# Altium project BPC_PWR_v1.1.PrjPcb (part 3 of 4)
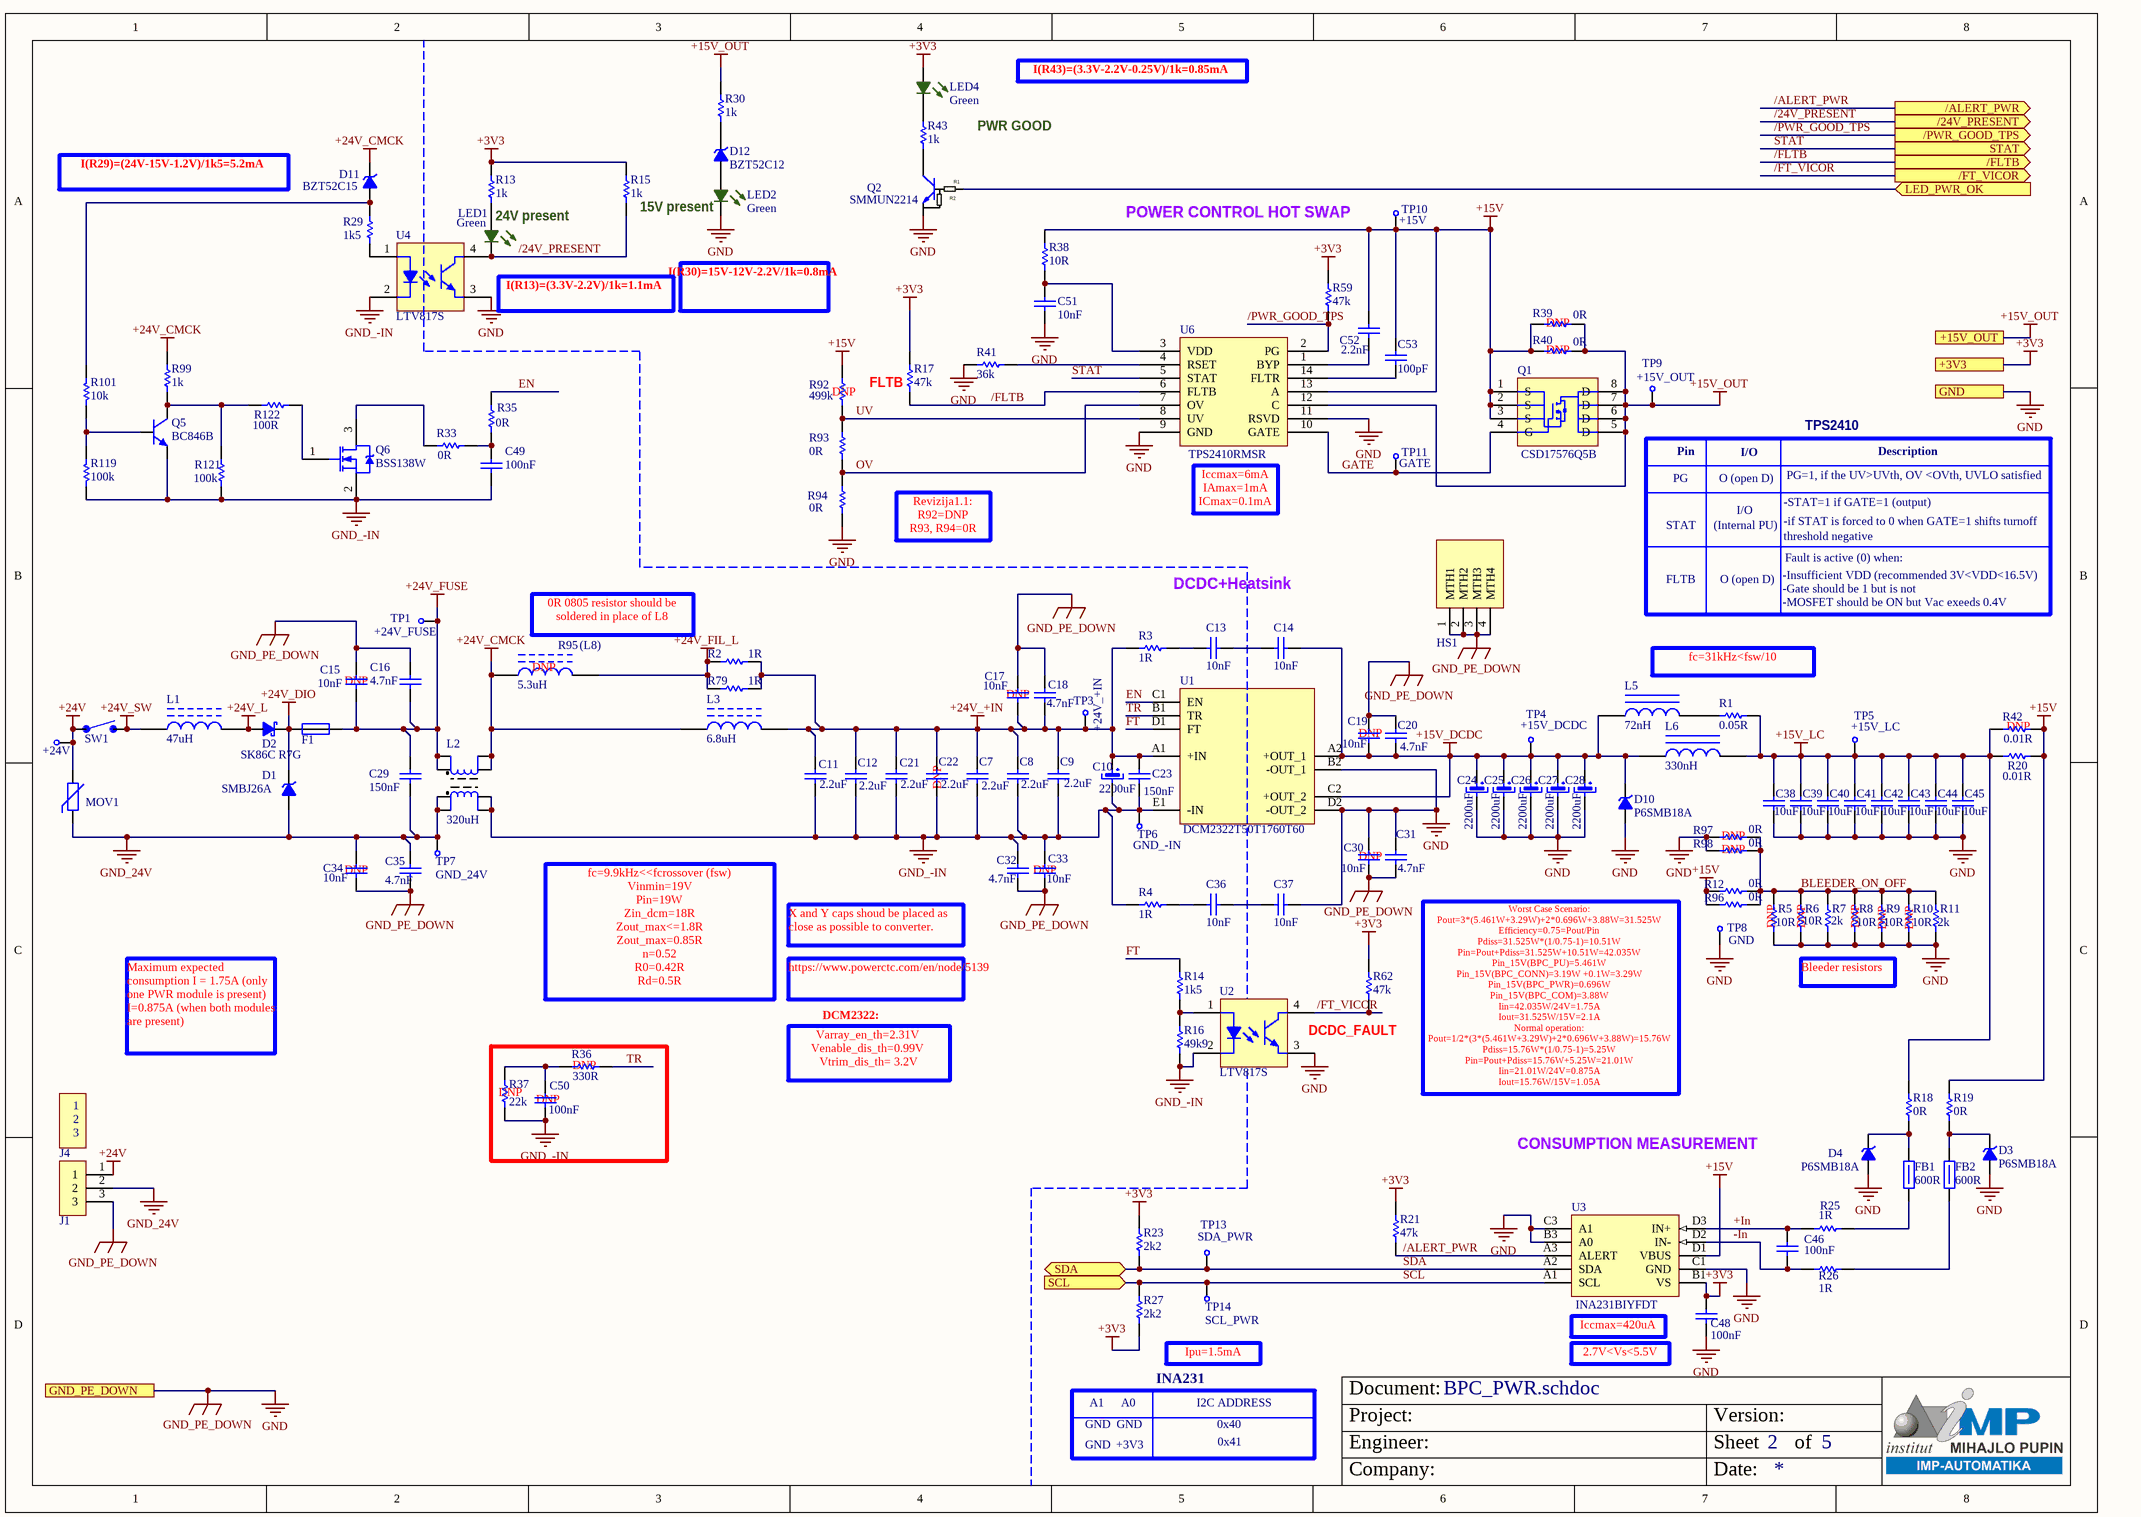
[diagram p6: BPC_PWR.schdoc]

## Sheet BPC_PWR.schdoc: Eurocard VME 6U (9.187 x 6.299 inches) (continued)
### Library data of the parts
+24V TP1 TP3-TP11 TP13 TP14 = Test Point SMD: Test Point SMD 1.2 mm No Via; DB Parameter 2: 1.2mm; DB Parameter 3: SMD No Via; Last Revision Date: 29.01.2018.; Package: N/A; Mounting: N/A; DB Parameter 1: *
C7-C9 C11 C12 C21 C22 = Cap Cer 2.2uF 450V X7R 2220 MS: Ceramic Capacitor 2.2uF 100V X6S 2220; Manufacturer: TDK Corporation; Manufacturer Part Number: C5750X6S2W225K250KA; Voltage: 450V; Tolerance: ±20%; Production status: Active; Distributor: Digi-Key; Distributor Part Number: 445-7781-1-ND; Last Revision Date: 09.03.2021; Temperature Range: -55°C ~ +125°C; Mounting: SMD; ComponentLink1Description: Datasheet; ComponentLink1URL: https://product.tdk.com/info/en/documents/chara_sheet/C5750X6S2W225K250KA.pdf; ComponentLink2Description: Distributor; ComponentLink2URL: https://www.digikey.com/en/products/detail/tdk-corporation/C5750X6S2W225K250KA/2733216?s=N4IgTCBcDaIMIFYDsCAMANAbAZTAdTDAQGkjViBBEAXQF8g; ComponentLink3Description: Manufacturer; ComponentLink3URL: https://product.tdk.com/en/search/capacitor/ceramic/mlcc/info?part_no=C5750X6S2W225K250KA; Status: Not Checked; Dielectric: X6S; ComponentLink4Description: Specsheet; ComponentLink4URL: https://product.tdk.com/info/en/documents/chara_sheet/C5750X6S2W225K250KA.pdf; DB Parameter 1: 2.2uF; DB Parameter 2: 450V; DB Parameter 3: X6S
C10 C24-C28 = Cap El 2200uF 35V 18x20mm MS: Electorlytic Capacitor 2200uF 35V 18x20mm MS; Manufacturer: Nichicon; Manufacturer Part Number: URZ1V222MHD; Tolerance: ±20%; Ripple Current: 1,27A @ 10KHz; Production Status: Active; Distributor: Digi-Key; Distributor Part Number: 493-15957-ND; Last Revision Date: 17.03.2021; Temperature Range: -55°C ~ +105°C; Mounting: TH; ComponentLink1Description: Datasheet; ComponentLink1URL: https://www.nichicon.co.jp/english/products/pdfs/e-urz.pdf; ComponentLink2Description: Distributor; ComponentLink2URL: https://www.digikey.com/en/products/detail/nichicon/URZ1V222MHD/2538996; ComponentLink3Description: Manufacturer; ComponentLink3URL: https://products.nichicon.co.jp/en/part_search/part_list.cfm#; Status: Unchecked; Voltage: 35V; ESR: -; DB Parameter 1: 2200uF; DB Parameter 2: 35V
C13 C14 C36 C37 = Cap Cer 10nF 2kV X7R 1812 MS: Ceramic Capacitor 10nF 2kV X7R 1812; Manufacturer: KEMET; Manufacturer Part Number: C1812C103KGRACTU; Tolerance: ±10%; Production status: Active; Distributor: Digi-Key; Distributor Part Number: 399-10477-1-ND; Last Revision Date: 12.03.2021; Temperature Range: -55°C ~ +125°C; Mounting: SMD; ComponentLink1Description: Datasheet; ComponentLink1URL: https://content.kemet.com/datasheets/KEM_C1010_X7R_HV_SMD.pdf; ComponentLink2Description: Distributor; ComponentLink2URL: https://www.digikey.com/en/products/detail/kemet/C1812C103KGRACTU/4172884?s=N4IgTCBcDaIMIEYAcCyIAwGYDSBxASgIJwAqAqiALoC%2BQA; ComponentLink3Description: Manufacturer; ComponentLink3URL: https://www.kemet.com/en/us/search.html?q=C1812C103KGRACTU; Status: Not Checked; Voltage: 2kV; Dielectric: X7R; ComponentLink4Description: Specsheet; ComponentLink4URL: https://connect.kemet.com:7667/gateway/IntelliData-ComponentDocumentation/1.0/download/specsheet/C1812C103KGRACTU; DB Parameter 1: 10nF; DB Parameter 2: 2kV; DB Parameter 3: X7R
C15 C17 C19 C30 C33 C34 = Cap Y2 10nF 275V Polypropylene  MS: Capacitor Y2 10nF 275V Polypropylene; Manufacturer: Kemet; Tolerance: ±20%; Production Status: Active; Distributor: Digi-Key; Distributor Part Number: 399-19749-ND; Manufacturer Part Number: R46KI21000001M; Last Revision Date: 23.07.2021; Temperature Range: -40°C ~ +110°C; Mounting: TH; ComponentLink1Description: Datasheet; ComponentLink1URL: https://www.kemet.com/en/us/search.html?q=R46KI21000001M; ComponentLink2Description: Distributor; ComponentLink2URL: https://www.digikey.com/en/products/detail/kemet/R46KI21000001M/9561693; ComponentLink3Description: Manufacturer; ComponentLink3URL: https://www.kemet.com/en/us/search.html?q=R46KI21000001M; Status: Not Checked; Voltage: 275V; Dielectric: Polypropylene; ComponentLink4Description: Charts; Capacitance: 10nF; DB Parameter 2: 275V; DB Parameter 3: Polypropylene
C16 C18 C20 C31 C32 C35 = Cap Y2 4.7nF 250V PET MS: Capacitor Y2 4.7nF 250V PET; Manufacturer: Kemet; Tolerance: ±10%; Production Status: Active; Distributor: Digi-Key; Distributor Part Number: 399-18570-ND; Manufacturer Part Number: R60QF14704001K; Last Revision Date: 23.07.2021; Temperature Range: -55°C ~ +105°C; Mounting: TH; ComponentLink1Description: Datasheet; ComponentLink1URL: https://content.kemet.com/datasheets/KEM_F3103_R60.pdf; ComponentLink2Description: Distributor; ComponentLink2URL: https://www.digikey.com/en/products/detail/kemet/R60QF14704001K/9556635; ComponentLink3Description: Manufacturer; ComponentLink3URL: https://www.kemet.com/en/us/search.html?q=R60QF14704001K; Status: Not Checked; Voltage: 250V; Dielectric: PET; ComponentLink4Description: Charts; Capacitance: 4.7nF; DB Parameter 2: 250V; DB Parameter 3: PET
C23 C29 = Cap X2 150nF 305V PP MS: Capacitor X2 150nF 305V PP; Manufacturer: WIMA; Manufacturer Part Number: MKX2AW31504C00KI00; Tolerance: ±10%; Dielectric: Polypropylene; Production Status: Active; Distributor: Mouser; Distributor Part Number: 505-MKX2AW31504C00KI; Last Revision Date: 15.03.2021; Temperature Range: -55°C ~ +105°C; Mounting: TH; ComponentLink1Description: Datasheet; ComponentLink1URL: https://www.wima.de/wp-content/uploads/media/e_WIMA_MKP-X2.pdf; ComponentLink2Description: Distributor; ComponentLink2URL: https://eu.mouser.com/ProductDetail/WIMA/MKX2AW31504C00KI00?qs=z5u5uZJqM4M14B9XXb1YIA%3D%3D; ComponentLink3Description: Manufacturer; ComponentLink3URL: https://www.wima.de/wp-content/uploads/media/e_WIMA_MKP-X2.pdf; Status: Not Checked; Voltage: 305V; ComponentLink4Description: Charts; Capacitance: 150nF; DB Parameter 2: 305V; DB Parameter 3: Polypropylene
C38-C45 = Cap Cer 10uF 100V X7S 2220 MS: Ceramic Capacitor 10uF 100V X7S 2220; Manufacturer: TDK Corporation; Manufacturer Part Number: C5750X7S2A106K230KB; Tolerance: ±10%; Production status: Active; Distributor: Digi-Key; Distributor Part Number: 445-13408-1-ND; Last Revision Date: 23.07.2021; Temperature Range: -55°C ~ +125°C; Mounting: SMD; ComponentLink1Description: Datasheet; ComponentLink1URL: https://product.tdk.com/en/system/files?file=dam/doc/product/capacitor/ceramic/mlcc/catalog/mlcc_commercial_midvoltage_en.pdf; ComponentLink2Description: Distributor; ComponentLink2URL: https://www.digikey.com/en/products/detail/tdk-corporation/C5750X7S2A106K230KB/3950644; ComponentLink3Description: Manufacturer; ComponentLink3URL: https://product.tdk.com/en/search/capacitor/ceramic/mlcc/info?part_no=C5750X7S2A106K230KB; Status: Not Checked; Voltage: 100V; Dielectric: X7S; ComponentLink4Description: Specsheet; ComponentLink4URL: https://product.tdk.com/en/search/capacitor/ceramic/mlcc/info?part_no=C5750X7S2A106K230KB; DB Parameter 1: 10uF; DB Parameter 2: 100V; DB Parameter 3: X7S
C46 C48-C50 = Cap Cer 100nF 50V X7R 0603 Pt02: Ceramic Capacitor 100nF 50V X7R 0603; Manufacturer: Samsung Electro-Mechanics; Manufacturer Part Number: CL10B104KB8WPNC; Tolerance: ±10%; Distributor: Mouser; Distributor Part Number: 187-CL10B104KB8WPNC; Last Revision Date: 19.10.2020.; Temperature Range: -55°C ~ +125°C; Mounting: SMD; ComponentLink1Description: Datasheet; ComponentLink1URL: https://eu.mouser.com/datasheet/2/396/mlcc02_e-1307760.pdf; ComponentLink2Description: Distributor; ComponentLink2URL: https://eu.mouser.com/ProductDetail/Taiyo-Yuden/JMK212BJ476MG-T?qs=I6KAKw0tg2zBfYZ1Prs1hQ%3D%3D; ComponentLink3Description: Manufacturer; ComponentLink3URL: https://ds.yuden.co.jp/TYCOMPAS/or/detail?pn=JMK212BBJ476MG-T&u=M; Status: Not Checked; Voltage: 50V; Dielectric: X7R; ComponentLink4Description: Charts; DB Parameter 1: 100nF; DB Parameter 2: 50V; DB Parameter 3: X7R
C51 = Cap Cer 10nF 50V X7R 0603 MS: Ceramic Capacitor 10nF 50V X7R 0603; Manufacturer: TDK Corporation; Manufacturer Part Number: CGA3E2X7R1H103K080AA; Tolerance: ±10%; Distributor: Digi-Key; Distributor Part Number: 445-5662-1-ND; Last Revision Date: 02.04.202; Temperature Range: -55°C ~ +125°C; Mounting: SMD; ComponentLink1Description: Datasheet; ComponentLink1URL: https://product.tdk.com/en/system/files?file=dam/doc/product/capacitor/ceramic/mlcc/catalog/mlcc_automotive_general_en.pdf; ComponentLink2Description: Distributor; ComponentLink2URL: https://www.digikey.com/en/products/detail/tdk-corporation/CGA3E2X7R1H103K080AA/2443140; ComponentLink3Description: Manufacturer; ComponentLink3URL: https://product.tdk.com/en/search/capacitor/ceramic/mlcc/info?part_no=CGA3E2X7R1H103K080AA; Status: Not Checked; Voltage: 50V; Dielectric: X7R; ComponentLink4Description: Charts; ComponentLink4URL: https://product.tdk.com/en/system/files?file=dam/doc/product/capacitor/ceramic/mlcc/charasheet/cga3e2x7r1h103k080aa.pdf; DB Parameter 1: 10nF; DB Parameter 2: 50V; DB Parameter 3: X7R
C52 = Cap Cer 2.2nF 100V X7R 0603 MS: Ceramic Capacitor 2.2nF 100V X7R 0603; Manufacturer: TDK Corporation; Manufacturer Part Number: CGA3E2X7R2A222K080AA; Tolerance: ±10%; Distributor: Digi-Key; Distributor Part Number: 445-5808-1-ND; Last Revision Date: 02.04.2021; Temperature Range: -55°C ~ +125°C; Mounting: SMD; ComponentLink1Description: Datasheet; ComponentLink1URL: https://product.tdk.com/en/system/files?file=dam/doc/product/capacitor/ceramic/mlcc/catalog/mlcc_automotive_midvoltage_en.pdf; ComponentLink2Description: Distributor; ComponentLink2URL: https://www.digikey.com/en/products/detail/tdk-corporation/CGA3E2X7R2A222K080AA/2443286; ComponentLink3Description: Manufacturer; ComponentLink3URL: https://product.tdk.com/en/search/capacitor/ceramic/mlcc/info?part_no=CGA3E2X7R2A222K080AA; Status: Not Checked; Voltage: 100V; Dielectric: X7R; ComponentLink4Description: Charts; ComponentLink4URL: https://product.tdk.com/en/system/files?file=dam/doc/product/capacitor/ceramic/mlcc/charasheet/cga3e2x7r2a222k080aa.pdf; DB Parameter 1: 2.2nF; DB Parameter 2: 100V; DB Parameter 3: X7R
C53 = Cap Cer 100pF 100V X7R 0603 MS: Ceramic Capacitor 100pF 100V X7R 0603; Manufacturer: AVX Corporation; Manufacturer Part Number: 06031C101JAT2A; Tolerance: ±5%; Distributor: Digi-Key; Distributor Part Number: 478-12671-1-ND; Last Revision Date: 02.04.202; Temperature Range: -55°C ~ +125°C; Mounting: SMD; ComponentLink1Description: Datasheet; ComponentLink1URL: https://datasheets.avx.com/X7RDielectric.pdf; ComponentLink2Description: Distributor; ComponentLink2URL: https://www.digikey.com/en/products/detail/avx-corporation/06031C101JAT2A/1598651; ComponentLink3Description: Manufacturer; ComponentLink3URL: https://spicat.avx.com/product/mlcc/chartview/06031C101JAT2A; Status: Not Checked; Voltage: 100V; Dielectric: X7R; ComponentLink4Description: Charts; ComponentLink4URL: https://spicat.avx.com/product/mlcc/chartview/06031C101JAT2A; DB Parameter 1: 100pF; DB Parameter 2: 100V; DB Parameter 3: X7R
D1 = Dio TVS Udir 26V 600W SMBJ26A MS: TVS Diode 26V 600W Unidirectional; Manufacturer: Bourns; DB Parameter 2: 42.1; Production status: Active; Clamping Voltage: 42.1V; Distributor: Digi-Key; Distributor Part Number: SMBJ26ABCT-ND; Manufacturer Part Number: SMBJ26A; Last Revision Date: 05.02.2021; Temperature Range: -55°C ~ +150°C; Mounting: SMD; ComponentLink1Description: Datasheet; ComponentLink1URL: https://www.bourns.com/docs/Product-Datasheets/SMBJ.pdf; ComponentLink2Description: Distributor; ComponentLink2URL: https://www.digikey.com/en/products/detail/bourns-inc/SMBJ26A/2254552; ComponentLink3Description: Manufacturer; ComponentLink3URL: https://www.bourns.com/docs/Product-Datasheets/SMBJ.pdf; Status: Checked; Working Voltage: 26V; Peak Pulse Power: 600W; DB Parameter 1: 26V; DB Parameter 3: 600W
D2 = Dio Sch 8A 60V SMC MS: Schottky Diode 8A 60V SMC; Manufacturer: Taiwan Semiconductor Corporation; Forward Voltage: 0.75V; Production status: Active; Distributor: Digi-Key; Distributor Part Number: SK86CR7GCT-ND; Manufacturer Part Number: SK86C R7G; Last Revision Date: 12.03.2021; Temperature Range: -55°C ~ +150°C; Mounting: SMC; ComponentLink1Description: Datasheet; ComponentLink1URL: https://www.taiwansemi.com/assets/uploads/datasheet/SK82C%20SERIES_K1903.pdf; ComponentLink2Description: Distributor; ComponentLink2URL: https://www.digikey.com/en/products/detail/taiwan-semiconductor-corporation/SK86C-R7G/7358693; ComponentLink3Description: Manufacturer; ComponentLink3URL: https://www.taiwansemi.com/assets/uploads/datasheet/SK82C%20SERIES_K1903.pdf; Status: Not Checked; Rated Current: 8A; DB Parameter 1: 0.75V; DB Parameter 2: 8A; DB Parameter 3: 60V; Forward current: 8A
D3 D4 D10 = Dio TVS Udir 15.3V 600W P6SMB18A MS: TVS Diode 15.3V 600W Unidirectional; Manufacturer: Bourns; DB Parameter 2: 25.5V; Production status: Active; Distributor: Digi-Key; Distributor Part Number: P6SMB18ABBCT-ND; Manufacturer Part Number: P6SMB18A; Last Revision Date: 26.03.2021; Temperature Range: -55°C ~ +150°C; Mounting: SMD; ComponentLink1Description: Datasheet; ComponentLink1URL: https://www.bourns.com/docs/Product-Datasheets/P6SMB.pdf; ComponentLink2Description: Distributor; ComponentLink2URL: https://www.digikey.com/en/products/detail/bourns-inc/P6SMB18A/5320280; ComponentLink3Description: Manufacturer; ComponentLink3URL: https://www.bourns.com/docs/Product-Datasheets/P6SMB.pdf; Status: Not Checked; Working Voltage: 15.3V; Peak Pulse Power: 600W; DB Parameter 1: 15.3V; DB Parameter 3: 600W; Clamping Voltage: 25.5V
D11 = Dio Zen 15V 500mW BZT52C15S  MS: Zener Diode 15V 500mW; Manufacturer: Diotec Semiconductor; Production Status: Active; Distributor: Mouser; Distributor Part Number: 637-BZT52C15; Manufacturer Part Number: BZT52C15; Last Revision Date: 01.08.2022; Temperature Range: -50°C ~ +150°C; Mounting: SMD; ComponentLink1Description: Datasheet; ComponentLink1URL: https://eu.mouser.com/datasheet/2/849/bzt52c2v4-2839333.pdf; ComponentLink2Description: Distributor; ComponentLink2URL: https://eu.mouser.com/ProductDetail/Diotec-Semiconductor/BZT52C15?qs=OlC7AqGiEDmIURskPBb0Sw%3D%3D; ComponentLink3Description: Manufacturer; ComponentLink3URL: https://diotec.com/en/product/BZT52C15.html; Status: Not Checked; Rated Power: 500mW; Zener Voltage: 15V; Parameter 1: 15V; Parameter 2: 500mW
D12 = Dio Zen 12V 500mW BZT52C12 MS: Zener Diode 12V 500mW; Manufacturer: Diodes Inc.; Manufacturer Part Number: BZT52C12-7-F; Production Status: Active; Distributor: Mouser; Distributor Part Number: 621-BZT52C12-F; Last Revision Date: 29.06.2020.; Temperature Range: -65°C ~ +150°C; Mounting: SMD; ComponentLink1Description: Datasheet; ComponentLink1URL: https://www.diodes.com/assets/Datasheets/ds18004.pdf; ComponentLink2Description: Distributor; ComponentLink2URL: https://eu.mouser.com/ProductDetail/Diodes-Incorporated/BZT52C12-7-F?qs=Qx62u%2Fq8dKJfMs49T6NTpw==; ComponentLink3Description: Manufacturer; ComponentLink3URL: https://www.diodes.com/part/view/BZT52C12; Status: Checked; Rated Power: 500mW; Zener Voltage: 12V; Parameter 1: 12V; Parameter 2: 500mW
F1 = FUSEHOLDER: FUSEHOLDER 10A 500V; Manufacturer: Schurter Inc.; Manufacturer Part Number: 0031.8221; VFB: 0.6V; Production Status: Active; Distributor: Digi-Key; Distributor Part Number: 486-1260-ND; Last Revision Date: 04.02.2021; Mounting: SMD; ComponentLink1Description: Datasheet; ComponentLink1URL: https://us.schurter.com/bundles/snceschurter/epim/_ProdPool_/newDS/en/typ_OGN-SMD.pdf; ComponentLink2Description: Distributor; ComponentLink2URL: https://www.digikey.com/en/products/detail/schurter-inc/0031-8221/669927; ComponentLink3Description: Manufacturer; ComponentLink3URL: https://www.schurter.com/en/datasheet/OGN-SMD#; Status: Not Checked; Rated Voltage: 500V; Rated Current: 10A; DB Parameter 1: 10A; DB Parameter 2: 500V
FB1 FB2 = FB 2A 600R 0805 Pt02 MS: Ferrite Bead 2A 600R@100MHz 0805; Manufacturer: Murata Electronics; Manufacturer Part Number: BLM21SP601SH1D; Rated Current: 2.3A; DC Resistance: 0.06R; Max Impedance Frequency: 110MHz; Tolerance: ±25%; Production status: Active; Distributor: Digi-Key; Distributor Part Number: 490-18588-1-ND; Last Revision Date: 26.07.2021; Temperature Range: -55°C ~ +125°C; Mounting: SMD; ComponentLink1Description: Datasheet; ComponentLink1URL: https://www.murata.com/en-us/api/pdfdownloadapi?cate=luNoiseSupprFilteChipFerriBead&partno=BLM21SP601SH1%23; ComponentLink2Description: Distributor; ComponentLink2URL: https://www.digikey.com/en/products/detail/murata-electronics/BLM21SP601SH1D/10135379; ComponentLink3Description: Manufacturer; ComponentLink3URL: https://www.murata.com/en-us/products/productdetail?partno=BLM21SP601SH1%23; Status: Not Checked; DB Parameter 1: 2A; DB Parameter 2: 600R; DB Parameter 3: 0.06R
HS1 = Mech Heatsink Vicor Transverse 40138: Heatsink Vicor Transverse 40138; Manufacturer Part Number: 40138; Thermal I/F: Yes; DB Parameter 3: PE tab; Production Status: Active; Distributor: Vicor; Distributor Part Number: 40138; Manufacturer: Vicor; Last Revision Date: 21.04.2021; Mounting: Heatsink; ComponentLink1Description: Datasheet; ComponentLink1URL: http://asp.vicorpower.com/CADPDF/6DDKOI.PDF; ComponentLink2Description: Distributor; ComponentLink2URL: http://www.vicorpower.com/products?productType=cfg&productKey=DCM2322T50T1760T60; ComponentLink3Description: Manufacturer; ComponentLink3URL: http://www.vicorpower.com/products?productType=cfg&productKey=DCM2322T50T1760T60; Status: Not Checked; Fins Direction: Transverse; DB Parameter 1: 40138; DB Parameter 2: Transverse
J1 = Con Header 1x3 5.08 Phoenix MS: Con Header 1x3 5.08 12A; Manufacturer: Phoenix Contact; Manufacturer Part Number: 1776511; Mating Part: MSTB 2,5/ 3-STF-5,08; DB Parameter 1: MSTB 2,5/ 3-GF-5,08; DB Parameter 3: 320V; Production Status: Active; Distributor: Digi-Key; Distributor Part Number: 277-5772-ND; Last Revision Date: 26.07.2021; Temperature Range: -40°C ~ +70°C; Mounting: TH; ComponentLink1Description: Datasheet; ComponentLink1URL: https://www.phoenixcontact.com/online/portal/pi/?uri=pxc-oc-itemdetail:pid=1776511&library=pien&pcck=P&tab=1&selectedCategory=ALL; ComponentLink2Description: Distributor; ComponentLink2URL: https://www.digikey.com/en/products/detail/phoenix-contact/1776511/349001?s=N4IgTCBcDaIIwHYEDYCsc4gLoF8g; ComponentLink3Description: Manufacturer; ComponentLink3URL: https://www.phoenixcontact.com/online/portal/pi/?uri=pxc-oc-itemdetail:pid=1776511&library=pien&pcck=P&tab=1&selectedCategory=ALL; Status: Not Checked; Rated Current: 12A; DB Parameter 2: 12A
J4 = Mech Con Cable 1x3 5.08 Phoenix MS: Con Header 1x3 5.08 12A; Manufacturer: Phoenix Contact; Manufacturer Part Number: 1777992; DB Parameter 1: MSTB 2,5/ 3-STF-5,08; DB Parameter 3: 320V; Production Status: Active; Distributor: Digi-Key; Distributor Part Number: 277-5712-ND; Last Revision Date: 26.07.2021; Temperature Range: -40°C ~ +70°C; Mounting: Cable; ComponentLink1Description: Datasheet; ComponentLink1URL: https://www.phoenixcontact.com/online/portal/pi/pxc/product_detail_page/!ut/p/z1/5VdJT-MwFP4rnUNvuHZWJ8cSGMpSaNUyNLlEjuNUZrLhmBb49WO3malAEA6IwyjRU2I7b_veEuXBCK5gVJINXxPJq5Lkah9GbmyeGciY2Mb0Bs8xmh9fnc7PTi_N-dSBv2AEo4bljEqWBkSydSWeYTi-utIvJElgaOhVTelvGM6AYQBkqrs-y3kiiOauOSt3TDxV7Bhj3zf1vspmQXD5VkxymTN1KHipbALKBX3kcpBURKQDWpWl8qUSAzCYLpbHA_PIGaKBBRbLn8A5Qp46_2vhrgvc-BrDqBv7Xh59cI3RZ_KhkscfMtxacKHh8rKRpKRMx-bdqB2CLJhi2zCxZ6xFlT5SecIk4XlzLllx_jq8H6btbR7qNCuqlLVqq4br6nhlRO2X7Em2Z-_kWqnISbl-JGutphu5gXqL3OwtcqO3yHvb55Pe9vmkt30-6W2fT3rb535v-9zvbbX7vf3C-VghD09giENrthrDCxWEpBhtaTFCo_qJjlqjcbqDFtdaqZqz-P3DQzSGkZpgpHZmpSM0RFuWDFFBuFq2gs0Q5byRO0G1ngXH8b-pp4kPjg9RSh0PExeDxLERsF3XBcRENmDMMhM3w4ble2qKiboGld0ctGPoGHQWrIxPTuPZKpidd4dnarvwbsPZFt6WlSjUiLnYB10nLUsS03RtH_jY0f76HvBchwDMqGUljBrUY1D9NXxiwfmihW71l-73qsffqj74qvcXXcUyvTHfLWVVu4dirrKsfTFETIhK7CsZ1kXhWS2B29XLkiUvr8lD1oFlT_H1tbN5Q_-bpPdsoXs7vNhst8usCBKvfTxvf_wBmlHkLA!!/; ComponentLink2Description: Distributor; ComponentLink2URL: https://www.digikey.com/en/products/detail/phoenix-contact/1777992/349030; ComponentLink3Description: Manufacturer; ComponentLink3URL: https://www.phoenixcontact.com/online/portal/pi/pxc/product_detail_page/!ut/p/z1/5VdJT-MwFP4rnUNvuHZWJ8cSGMpSaNUyNLlEjuNUZrLhmBb49WO3malAEA6IwyjRU2I7b_veEuXBCK5gVJINXxPJq5Lkah9GbmyeGciY2Mb0Bs8xmh9fnc7PTi_N-dSBv2AEo4bljEqWBkSydSWeYTi-utIvJElgaOhVTelvGM6AYQBkqrs-y3kiiOauOSt3TDxV7Bhj3zf1vspmQXD5VkxymTN1KHipbALKBX3kcpBURKQDWpWl8qUSAzCYLpbHA_PIGaKBBRbLn8A5Qp46_2vhrgvc-BrDqBv7Xh59cI3RZ_KhkscfMtxacKHh8rKRpKRMx-bdqB2CLJhi2zCxZ6xFlT5SecIk4XlzLllx_jq8H6btbR7qNCuqlLVqq4br6nhlRO2X7Em2Z-_kWqnISbl-JGutphu5gXqL3OwtcqO3yHvb55Pe9vmkt30-6W2fT3rb535v-9zvbbX7vf3C-VghD09giENrthrDCxWEpBhtaTFCo_qJjlqjcbqDFtdaqZqz-P3DQzSGkZpgpHZmpSM0RFuWDFFBuFq2gs0Q5byRO0G1ngXH8b-pp4kPjg9RSh0PExeDxLERsF3XBcRENmDMMhM3w4ble2qKiboGld0ctGPoGHQWrIxPTuPZKpidd4dnarvwbsPZFt6WlSjUiLnYB10nLUsS03RtH_jY0f76HvBchwDMqGUljBrUY1D9NXxiwfmihW71l-73qsffqj74qvcXXcUyvTHfLWVVu4dirrKsfTFETIhK7CsZ1kXhWS2B29XLkiUvr8lD1oFlT_H1tbN5Q_-bpPdsoXs7vNhst8usCBKvfTxvf_wBmlHkLA!!/; Status: Not Checked; Rated Current: 12A; DB Parameter 2: 12A; Mating Part: MSTB 2,5/ 3-STF-5,08
L1 = Ind  47uH 2.6A SER1390: Inductor 47uH 2.6A 2.31 MOHM; Manufacturer: Coilcraft; Manufacturer Part Number: SER1390-473MLB; Tolerance: ±20%; Saturation Current: 5.7A; DC Resistance: 0.0231R; Core Material: Ferrite; Distributor: Mouser; Distributor Part Number: 994-SER1390-473MLB; Last Revision Date: 10.03.2021; Temperature Range: -40°C ~ +85°C; Mounting: SMD; ComponentLink1Description: Datasheet; ComponentLink1URL: https://www.coilcraft.com/getmedia/e42d9f84-9826-47b6-9630-253562c4dcd4/ser1390.pdf; ComponentLink2Description: Distributor; ComponentLink2URL: https://eu.mouser.com/ProductDetail/Coilcraft/SER1390-473MLB?qs=mBwMfv9Clf364iVQiAVtgQ%3D%3D; ComponentLink3Description: Manufacturer; ComponentLink3URL: https://www.coilcraft.com/en-us/products/power/shielded-inductors/high-current-flat-wire/ser/ser1390/ser1390-473/; Status: Not Checked; DB Parameter 1: 47uH; DB Parameter 2: 2.6A; DB Parameter 3: 0.0231R; Rated Current: 2.6A
L2 = Ind CMC 320µH  3.25A 744290321 MS: Inductor 320uH 3.25A 744290321; Manufacturer: Würth Elektronik; DC Resistance: 0.029R; Core Material: Ferrite; Distributor: Digi-Key; Distributor Part Number: 732-5616-1-ND; Manufacturer Part Number: 744290321; Last Revision Date: 05.02.2021; Temperature Range: -40°C ~ 125°C; Mounting: SMD; ComponentLink1Description: Datasheet; ComponentLink1URL: https://www.we-online.de/katalog/datasheet/744290321.pdf; ComponentLink2Description: Distributor; ComponentLink2URL: https://www.digikey.com/en/products/detail/w%C3%BCrth-elektronik/744290321/4865725?s=N4IgTCBcDaIOwBYFgJwAYDMYCMIC6AvkA; ComponentLink3Description: Manufacturer; ComponentLink3URL: https://www.we-online.com/catalog/en/WE-UCF?sq=744290321&sp=https%3A%2F%2Fwww.we-online.com%2Fweb%2Fen%2Fwuerth_elektronik%2Fsearchpage.php%3Fsearch%3D744290321#744290321; Status: Not Checked; Saturation Current: 3.25A; DB Parameter 1: 320uH; DB Parameter 2: 3.25A; DB Parameter 3: 0.029R; Rated Current: 3.25A
L3 = Ind  6.8uH 6.01A MSS1048 MS: Inductor 6.8uH 6.01A 15.4 MOHM; Manufacturer: Coilcraft; Manufacturer Part Number: MSS1048-682NLC; Tolerance: ±30%; Saturation Current: 5.94A; DC Resistance: 0.0154R; Core Material: Ferrite; DB Parameter 2: 7.7A; Distributor: Mouser; Distributor Part Number: 994-MSS1048-682NLC; Last Revision Date: 13.10.2021; Temperature Range: -40°C ~ +85°C; Mounting: SMD; ComponentLink1Description: Datasheet; ComponentLink1URL: https://www.coilcraft.com/getmedia/bd5140ec-db32-4346-a029-5182269dc08e/mss1048.pdf; ComponentLink2Description: Distributor; ComponentLink2URL: https://eu.mouser.com/ProductDetail/Coilcraft/MSS1048-682NLC?qs=zCSbvcPd3pbSSO8E72SmNA%3D%3D; ComponentLink3Description: Manufacturer; ComponentLink3URL: https://www.coilcraft.com/en-us/products/power/shielded-inductors/ferrite-drum/mss-mos/mss1048/?skuId=5412|7778; Status: Not Checked; DB Parameter 1: 6.8uH; DB Parameter 3: 0.0154R; Rated Current: 6.01A
L5 = Ind 72nH 45A IFLR2727 MS: Inductor 72nH 45A IFLR2727; Manufacturer: Vishay Dale; Manufacturer Part Number: IFLR2727EZER72NM01; Tolerance: ±20%; Saturation Current: 58A; DC Resistance: 0.035R; Distributor: Digi-Key; Distributor Part Number: 541-3104-1-ND; Last Revision Date: 17.03.2021; Temperature Range: -40°C ~ +125°C; Mounting: SMD; ComponentLink1Description: Datasheet; ComponentLink1URL: https://www.vishay.com/docs/34420/iflr-2727ez-01.pdf; ComponentLink2Description: Distributor; ComponentLink2URL: https://www.digikey.com/en/products/detail/vishay-dale/IFLR2727EZER72NM01/6181814?s=N4IgTCBcDaIJIDEAyAlMB2DBRAWllmAcgLIAMAjCALoC%2BQA; ComponentLink3Description: Manufacturer; ComponentLink3URL: https://www.vishay.com/docs/34420/iflr-2727ez-01.pdf; Status: Not Checked; DB Parameter 1: 72nH; DB Parameter 2: 45A; DB Parameter 3: 0.035R; Rated Current: 45A
L6 = Ind 330nH 29.5A IHLP3232 MS: Inductor 330nH 29.5A IHLP3232; Manufacturer: Vishay Dale; Manufacturer Part Number: IHLP3232DZERR33M01; Tolerance: ±20%; Saturation Current: 36A; DC Resistance: 0.00214R; DB Parameter 2: 45A; Distributor: Digi-Key; Distributor Part Number: 541-1379-1-ND; Last Revision Date: 17.03.2021; Temperature Range: -55°C ~ +125°C; Mounting: SMD; ComponentLink1Description: Datasheet; ComponentLink1URL: https://www.vishay.com/docs/34316/ihlp-3232dz-01.pdf; ComponentLink2Description: Distributor; ComponentLink2URL: https://www.digikey.com/en/products/detail/vishay-dale/IHLP3232DZERR33M01/2657475; ComponentLink3Description: Manufacturer; ComponentLink3URL: https://www.vishay.com/docs/34316/ihlp-3232dz-01.pdf; Status: Not Checked; DB Parameter 1: 330nH; DB Parameter 3: 0.00214R; Rated Current: 29.5A
LED1 LED2 LED4 = LED Mentor 2632.8380 GRN x1 MS: LED Mentor 2632.8320 GRN x1; Forward Current: 20mA; Luminous Intensity: 10-20 mcd; Forward Voltage: 2.2V; DB Parameter 3: 568nm; Production Status: Active; Distributor: Mentor; Distributor Part Number: 2632.8380; Manufacturer: Mentor; Manufacturer Part Number: 2632.8380; Last Revision Date: 30.03.2021; Temperature Range: -40°C ~ +85°C; Mounting: TH; ComponentLink1Description: Datasheet; ComponentLink1URL: https://www.mentor.de.com/productpdfs/opto/1145.pdf; ComponentLink2Description: Distributor; ComponentLink2URL: https://www.mentor.de.com/bauelemente/en/product/en-2632-8380/; ComponentLink3Description: Manufacturer; ComponentLink3URL: https://www.mentor.de.com/bauelemente/en/product/en-2632-8380/; Status: Not Checked; DB Parameter 1: Green; DB Parameter 2: 2.2V; LED Color: Green
MOV1 = MOV 47V 5.5J 10D470K: Varistor 47V 500A DISC 10MM; Manufacturer: Bourns Inc.; Manufacturer Part Number: MOV-10D470KTR; Rated Energy: 5.5J; Clamping Voltage: 93V; Distributor: Digi-Key; Distributor Part Number: MOV-10D470KTRCT-ND; Last Revision Date: 05.02.2021; Temperature Range: -55°C ~ +105°C; Mounting: TH; ComponentLink1Description: Datasheet; ComponentLink1URL: https://www.bourns.com/docs/Product-Datasheets/MOV10D.pdf; ComponentLink2Description: Distributor; ComponentLink2URL: https://www.digikey.com/en/products/detail/bourns-inc/mov-10d470ktr/2407607; ComponentLink3Description: Manufacturer; ComponentLink3URL: https://www.bourns.com/docs/product-datasheets/mov10d.pdf?sfvrsn=b57e8a7f_26; Status: Not Checked
Q1 = Tr CSD17576Q5B MS: MOSFET N-CH 30V 100A 8VSON; Manufacturer: Texas Instruments; Vds: 30; Vgs: +/-20V; DB Parameter 3: 2.4mR; Production Status: Active; Distributor: Digi-Key; Distributor Part Number: 296-43635-1-ND; Last Revision Date: 11.10.2022; Temperature Range: -55°C ~ +150°C; Mounting: SMD; ComponentLink1Description: Datasheet; ComponentLink1URL: https://www.ti.com/lit/ds/symlink/csd17576q5b.pdf?ts=1668068230097; ComponentLink2Description: Distributor; ComponentLink2URL: https://www.digikey.com/en/products/detail/texas-instruments/CSD17576Q5B/4914144; ComponentLink3Description: Manufacturer; ComponentLink3URL: https://www.ti.com/product/CSD17576Q5B#cad-cae-symbols; Status: Not Checked; DB Parameter 1: CSD17576Q5B; DB Parameter 2: 30V; Manufacturer Part Number: CSD17576Q5B; Rdson: 2.4mR
Q2 = Tra NPN Prebias MS: TRANS PREBIAS NPN 50V SOT23; Manufacturer: ON Semiconductor; Manufacturer Part Number: SMMUN2214LT1G; Ic Max: 100mA; Resistor Base: 10k; Resistor Emitter Base: 47k; hFE Min: 80; Production Status: Active; Power Rating: 246mW; Vces: 0.25V; Distributor: Digi-Key; Distributor Part Number: SMMUN2214LT1GOSCT-ND; Last Revision Date: 29.07.2021; Temperature Range: -55°C ~ +150°C; Vcebo: 50V; Mounting: SMD; DB Parameter 1: 10k; DB Parameter 2: 47k; DB Parameter 3: 100mA; ComponentLink1Description: Datasheet; ComponentLink1URL: https://www.onsemi.com/pdf/datasheet/dtc114y-d.pdf; ComponentLink2Description: Distributor; ComponentLink2URL: https://www.digikey.com/en/products/detail/on-semiconductor/SMMUN2214LT1G/3062798; ComponentLink3Description: Manufacturer; ComponentLink3URL: https://www.onsemi.com/products/discretes-drivers/digital-transistors-brts/mmun2214l
Q5 = Tra NPN BC846B MS: 65V, 100mA NPN general-purpose transistor; Manufacturer: Nexperia; Manufacturer Part Number: BC846B,215; Power Rating: 250mW; hfe: 200 ~ 450; Production status: Active; Distributor: Mouser; Distributor Part Number: 771-BC846B-T/R; Last Revision Date: 03.08.2021; Temperature Range: -65°C ~ +150°C; Mounting: SMD; ComponentLink1Description: Datasheet; ComponentLink1URL: https://eu.mouser.com/datasheet/2/916/BC846X_SER-2937540.pdf; ComponentLink2Description: Distributor; ComponentLink2URL: https://eu.mouser.com/ProductDetail/Nexperia/BC846B215/?qs=sGAEpiMZZMshyDBzk1%2FWi7dklbCN21lX08PuvlTNczo%3D; ComponentLink3Description: Manufacturer; ComponentLink3URL: https://www.nexperia.com/products/bipolar-transistors/general-purpose-and-low-vcesat-bipolar-transistors/single-bipolar-transistors/single-bipolar-transistors-100-v/BC846B.html; Status: Checked; Ic max: 100mA; Vceo: 65V; DB Parameter 1: 100mA; DB Parameter 2: 65V
Q6 = Tra N-CH BSS138W MS: MOSFET N-CH 50V 210MA SC70; Manufacturer: ON Semiconductor; Vgs th: 1.3V; Vgs max: 1.5V; Rds: 3.5R; DB Parameter 1: 0.21A; Production Status: Active; Distributor: Digi-Key; Distributor Part Number: BSS138WCT-ND; Manufacturer Part Number: BSS138W; Last Revision Date: 30.07.2021; Temperature Range: -55°C ~ +150°C; Id max: 210mA; Vds max: 50V; Mounting: SMD; DB Parameter 2: 1.3V; DB Parameter 3: 3.5R; ComponentLink1Description: Datasheet; ComponentLink1URL: https://www.onsemi.com/pdf/datasheet/bss138w-d.pdf; ComponentLink2Description: Distributor; ComponentLink2URL: https://www.digikey.com/en/products/detail/on-semiconductor/BSS138W/2804105; ComponentLink3Description: Manufacturer; ComponentLink3URL: https://www.onsemi.com/products/discretes-drivers/mosfets/bss138
R1 = Res 0.05R 1% 1W 2512 MS: Resistor 0.05R 1% 1W 2512; Manufacturer: Yageo; Manufacturer Part Number: RL2512FK-070R05L; Temperature Coefficient: ±800ppm/°C; Production Status: Active; Distributor: Digi-Key; Distributor Part Number: 311-0.05TCT-ND; Last Revision Date: 17.03.2021; Temperature Range: -55°C ~ +155°C; Mounting: SMD; ComponentLink1Description: Datasheet; ComponentLink1URL: https://www.yageo.com/upload/media/product/productsearch/datasheet/rchip/PYu-RL_Group_521_RoHS_L_2.pdf; ComponentLink2Description: Distributor; ComponentLink2URL: https://www.digikey.com/en/products/detail/yageo/RL2512FK-070R05L/3885862?s=N4IgTCBcDaIEoBkwFYCMYBiBpAtABgHY849kEQBdAXyA; ComponentLink3Description: Manufacturer; ComponentLink3URL: https://www.yageo.com/en/ProductSearch/PartNumberSearch?part_number=RL2512FK-070R05L; Status: Not Checked; Power Rating: 1W; Tolerance: ±1%; DB Parameter 1: 0.05R; DB Parameter 2: ±1%; DB Parameter 3: 1W
R2-R4 R79 = Res 1R 5% 1W 2512 MS: Resistor 1R 5% 1W 2512; Manufacturer: KOA Speer Electronics, Inc.; Manufacturer Part Number: SR733ATTE1R00F; Temperature Coefficient: ±100ppm/°C; Production Status: Active; Distributor: Digi-Key; Distributor Part Number: 2019-SR733ATTE1R00FCT-ND; Last Revision Date: 26.07.2021; Temperature Range: -55°C ~ +150°C; Mounting: SMD; ComponentLink1Description: Datasheet; ComponentLink1URL: https://www.koaspeer.com/pdfs/SR73.pdf; ComponentLink2Description: Distributor; ComponentLink2URL: https://www.digikey.com/en/products/detail/koa-speer-electronics-inc/SR733ATTE1R00F/9845653; ComponentLink3Description: Manufacturer; ComponentLink3URL: https://www.koaspeer.com/pdfs/SR73.pdf; Status: Not Checked; Power Rating: 1W; Tolerance: ±5%; DB Parameter 1: 1R; DB Parameter 2: ±5%; DB Parameter 3: 1W
R5 R6 R8-R10 = Res 10R 5% 2W 2512 MS: Resistor 10R 5% 2W 2512 MS; Manufacturer: Yageo; Manufacturer Part Number: SR2512JK-7W10RL; Temperature Coefficient: ±200ppm/°C; Production Status: Active; Distributor: Digi-Key; Distributor Part Number: YAG5928CT-ND; Last Revision Date: 17.03.2021; Temperature Range: -55°C ~ +155°C; Mounting: SMD; ComponentLink1Description: Datasheet; ComponentLink1URL: https://www.yageo.com/upload/media/product/productsearch/datasheet/rchip/PYu-SR_20105_RoHS_L_8.pdf; ComponentLink2Description: Distributor; ComponentLink2URL: https://www.digikey.com/en/products/detail/yageo/SR2512JK-7W10RL/9373197; ComponentLink3Description: Manufacturer; ComponentLink3URL: https://www.yageo.com/upload/media/product/productsearch/datasheet/rchip/PYu-SR_20105_RoHS_L_8.pdf; Status: Not Checked; Power Rating: 2W; Tolerance: ±5%; DB Parameter 1: 10R; DB Parameter 2: ±5%; DB Parameter 3: 2W
R7 R11 = Res 2k 1% 2W 2512 MS: Resistor 2k 1% 2W 2512 MS; Manufacturer: TE Connectivity / Holsworthy; Manufacturer Part Number: 35212K0FT; Temperature Coefficient: ±100ppm/°C; Production Status: Active; Distributor: Mouser; Distributor Part Number: 279-35212K0FT; Last Revision Date: 28.06.2023; Temperature Range: -55°C ~ +155°C; Mounting: SMD; ComponentLink1Description: Datasheet; ComponentLink1URL: https://www.te.com/usa-en/product-5-2176070-6.html; ComponentLink2Description: Distributor; ComponentLink2URL: https://eu.mouser.com/ProductDetail/TE-Connectivity-Holsworthy/35212K0FT?qs=IXkKOuu5vnFoCcMIqznxug%3D%3D; ComponentLink3Description: Manufacturer; ComponentLink3URL: https://www.te.com/usa-en/product-5-2176070-6.html; Status: Not Checked; Power Rating: 2W; Tolerance: ±1%; DB Parameter 1: 2k; DB Parameter 2: ±1%; DB Parameter 3: 2W
R12 R33 R35 R93 R94 R96-R98 = Res 0R 100mW 0603: Resistor  0R 100mW 0603; Manufacturer: Stackpole Electronics Inc; Manufacturer Part Number: RMCF0603ZT0R00; DB Parameter 2: 1A; Production Status: Active; Maximum Current: 2A; Distributor: Digi-Key; Distributor Part Number: RMCF0603ZT0R00CT-ND; Last Revision Date: 20.10.2020.; Temperature Range: -55°C ~ +155°C; Mounting: SMD; ComponentLink1Description: Datasheet; ComponentLink1URL: https://www.seielect.com/catalog/sei-rmcf_rmcp.pdf; ComponentLink2Description: Distributor; ComponentLink2URL: https://www.digikey.com/en/products/detail/stackpole-electronics-inc/RMCF0603ZT0R00/1756908; ComponentLink3Description: Manufacturer; ComponentLink3URL: https://www.seielect.com/; Status: Not Checked; Power Rating: 100mW; DB Parameter 1: 0R; DB Parameter 3: 100mW; Rated Current: 1A
R13 R15 R30 R43 R99 = Res 1k 1% 125mW 0603: Resistor 1k 1% 125mW 0603; Manufacturer: Vishay Beyschlag/Draloric/BC Components; Manufacturer Part Number: MCT06030C1001FP500; Temperature Coefficient: ±50 PPM/°C; Production Status: Active; Distributor: Digi-Key; Distributor Part Number: MCT0603-1.00K-CFCT-ND; Last Revision Date: 22.10.2020.; Temperature Range: -55°C ~ +155°C; Mounting: SMD; ComponentLink1Description: Datasheet; ComponentLink1URL: https://www.vishay.com/docs/28705/mcx0x0xpro.pdf; ComponentLink2Description: Distributor; ComponentLink2URL: https://www.digikey.com/en/products/detail/vishay-beyschlag-draloric-bc-components/MCT06030C1001FP500/2607821; ComponentLink3Description: Manufacturer; ComponentLink3URL: https://www.vishay.com/search?query=MCT06030C1001FP500&searchChoice=part; Status: Not Checked; Power Rating: 125mW; Tolerance: ±1%; DB Parameter 2: ±1%; DB Parameter 3: 125mW; DB Parameter 1: 1k
R14 R29 = Res 1k5 1% 100mW 0603 MS: Resistor 1k5 1% 100mW 0603; Manufacturer: Vishay Dale; Manufacturer Part Number: CRCW06031K50FKEAC; Temperature Coefficient: ±100ppm/°C; Production Status: Active; Distributor: Digi-Key; Distributor Part Number: 541-4020-1-ND; Last Revision Date: 26.07.2021; Temperature Range: -55°C ~ +155°C; Mounting: SMD; ComponentLink1Description: Datasheet; ComponentLink1URL: https://www.vishay.com/docs/28773/crcwce3.pdf; ComponentLink2Description: Distributor; ComponentLink2URL: https://www.digikey.com/en/products/detail/vishay-dale/CRCW06031K50FKEAC/7928442; ComponentLink3Description: Manufacturer; ComponentLink3URL: https://www.vishay.com/docs/28773/crcwce3.pdf; Status: Not Checked; Power Rating: 100mW; Tolerance: ±1%; DB Parameter 1: 1k5; DB Parameter 2: ±1%; DB Parameter 3: 100mW
R16 = Res 49k9 1% 100mW 0603: Resistor 49k9 1% 100mW 0603; Manufacturer: Yageo; Manufacturer Part Number: RC0603FR-0749K9L; Temperature Coefficient: ±100ppm/°C; Production Status: Active; Distributor: Digi-Key; Distributor Part Number: 311-49.9KHRCT-ND; Last Revision Date: 28.10.2020; Temperature Range: -55°C ~ +155°C; Mounting: SMD; ComponentLink1Description: Datasheet; ComponentLink1URL: https://www.yageo.com/upload/media/product/productsearch/datasheet/rchip/PYu-RC_Group_51_RoHS_L_11.pdf; ComponentLink2Description: Distributor; ComponentLink2URL: https://www.digikey.com/en/products/detail/yageo/RC0603FR-0749K9L/727265; ComponentLink3Description: Manufacturer; ComponentLink3URL: https://www.yageo.com/en/ProductSearch/PartNumberSearch?part_number=RC0603FR-0749K9L; Status: Not Checked; Power Rating: 100mW; Tolerance: ±1%; DB Parameter 1: 49k9; DB Parameter 2: ±1%; DB Parameter 3: 100mW
R17 R21 R59 R62 = Res 47k 1% 100mW 0603 MS: Resistor 47k 1% 100mW 0603; Manufacturer: Yageo; Manufacturer Part Number: RT0603FRE0747KL; Temperature Coefficient: ±50ppm/°C; Production Status: Active; Distributor: Digi-Key; Distributor Part Number: YAG3355CT-ND; Last Revision Date: 08.06.2021; Temperature Range: -55°C ~ +155°C; Mounting: SMD; ComponentLink1Description: Datasheet; ComponentLink1URL: https://www.yageo.com/upload/media/product/productsearch/datasheet/rchip/PYu-RT_1-to-0.01_RoHS_L_12.pdf; ComponentLink2Description: Distributor; ComponentLink2URL: https://www.digikey.com/en/products/detail/yageo/RT0603FRE0747KL/1075386; ComponentLink3Description: Manufacturer; ComponentLink3URL: https://www.yageo.com/en/ProductSearch/PartNumberSearch?part_number=RT0603FRE0747KL; Status: Not Checked; Power Rating: 100mW; Tolerance: ±1%; DB Parameter 1: 47k; DB Parameter 2: ±1%; DB Parameter 3: 100mW
R18 R19 = Res 0R 125mW 0805: Resistor  0R 125mW 0805; Manufacturer: Yageo; Manufacturer Part Number: RC0805JR-070RL; DB Parameter 2: 2A; Production Status: Active; Maximum Current: 5A; Distributor: Digi-Key; Distributor Part Number: 311-0.0ARCT-ND; Last Revision Date: 19.10.2020.; Temperature Range: -55°C ~ +155°C; Mounting: SMD; ComponentLink1Description: Datasheet; ComponentLink1URL: https://www.yageo.com/upload/media/product/productsearch/datasheet/rchip/PYu-RC_Group_51_RoHS_L_11.pdf; ComponentLink2Description: Distributor; ComponentLink2URL: https://www.digikey.com/en/products/detail/yageo/RC0805JR-070RL/731163; ComponentLink3Description: Manufacturer; ComponentLink3URL: https://www.yageo.com/en/ProductSearch/PartNumberSearch?part_number=RC0805JR-070RL; Status: Not Checked; Power Rating: 125mW; DB Parameter 1: 0R; DB Parameter 3: 125mW; Rated Current: 2A
R20 R42 = Res 0.01R 1% 2W 2512 MS: Resistor 0.01R 1% 2W 2512; Manufacturer: Yageo; Manufacturer Part Number: PE2512FKF7W0R01L; Temperature Coefficient: ±100ppm/°C; Production Status: Active; Distributor: Digi-Key; Distributor Part Number: YAG6033CT-ND; Last Revision Date: 25.03.2021; Temperature Range: -55°C ~ +170°C; Mounting: SMD; ComponentLink1Description: Datasheet; ComponentLink1URL: https://www.yageo.com/upload/media/product/productsearch/datasheet/rchip/PYu-PE_521_RoHS_L_8.pdf; ComponentLink2Description: Distributor; ComponentLink2URL: https://www.digikey.com/en/products/detail/yageo/PE2512FKF7W0R01L/5914917; ComponentLink3Description: Manufacturer; ComponentLink3URL: https://www.yageo.com/en/ProductSearch/PartNumberSearch?part_number=PE2512FKF7W0R01L; Status: Not Checked; Power Rating: 2W; Tolerance: ±1%; DB Parameter 1: 0.01R; DB Parameter 2: ±1%; DB Parameter 3: 2W
R23 R27 = Res 2k2 1% 100mW 0603 MS Pt02: Resistor 2k2 1% 100mW 0603; Manufacturer: Yageo; Manufacturer Part Number: RC0603FR-072K2L; Temperature Coefficient: ±100ppm/°C; Production Status: Active; Distributor: Digi-Key; Distributor Part Number: 311-2.20KHRCT-ND; Last Revision Date: 30.07.2021; Temperature Range: -55°C ~ +155°C; Mounting: SMD; ComponentLink1Description: Datasheet; ComponentLink1URL: https://www.yageo.com/upload/media/product/productsearch/datasheet/rchip/PYu-RC_Group_51_RoHS_L_11.pdf; ComponentLink2Description: Distributor; ComponentLink2URL: https://www.digikey.com/en/products/detail/yageo/RC0603FR-072K2L/727016; ComponentLink3Description: Manufacturer; ComponentLink3URL: https://www.yageo.com/en/ProductSearch/PartNumberSearch?part_number=RC0603FR-072K2L; Status: Not Checked; Power Rating: 100mW; Tolerance: ±1%; DB Parameter 1: 2k2; DB Parameter 2: ±1%; DB Parameter 3: 100mW
R25 R26 = Res 1R 1% 100mW 0603 MS: Resistor 1R 1% 100mW 0603; Manufacturer: Stackpole Electronics Inc; Manufacturer Part Number: RC0603FR-071RL; Temperature Coefficient: ±200ppm/°C; Production Status: Active; Distributor: Digi-Key; Distributor Part Number: 311-1.00HRCT-ND; Last Revision Date: 26.07.2021; Temperature Range: -55°C ~ +155°C; Mounting: SMD; ComponentLink1Description: Datasheet; ComponentLink1URL: https://www.yageo.com/upload/media/product/productsearch/datasheet/rchip/PYu-RC_Group_51_RoHS_L_11.pdf; ComponentLink2Description: Distributor; ComponentLink2URL: https://www.digikey.com/en/products/detail/yageo/RC0603FR-071RL/726842; ComponentLink3Description: Manufacturer; ComponentLink3URL: https://www.yageo.com/en/ProductSearch/PartNumberSearch?part_number=RC0603FR-071RL; Status: Not Checked; Power Rating: 100mW; Tolerance: ±1%; DB Parameter 1: 1R; DB Parameter 2: ±1%; DB Parameter 3: 100mW
R36 = Res 330R 1% 100mW 0603 MS: Resistor 330R 1% 100mW 0603; Manufacturer: Yageo; Manufacturer Part Number: RC0603FR-07330RL; Temperature Coefficient: ±100ppm/°C; DB Parameter 2: ±1%±5%; Production Status: Active; Distributor: Digi-Key; Distributor Part Number: 311-330HRCT-ND; Last Revision Date: 26.07.2021; Temperature Range: -55°C ~ +155°C; Mounting: SMD; ComponentLink1Description: Datasheet; ComponentLink1URL: https://www.yageo.com/upload/media/product/productsearch/datasheet/rchip/PYu-RC_Group_51_RoHS_L_11.pdf; ComponentLink2Description: Distributor; ComponentLink2URL: https://www.digikey.com/en/products/detail/yageo/RC0603FR-07330RL/727162; ComponentLink3Description: Manufacturer; ComponentLink3URL: https://www.yageo.com/en/ProductSearch/PartNumberSearch?part_number=RC0603FR-07330RL; Status: Not Checked; Power Rating: 100mW; Tolerance: ±1%; DB Parameter 1: 330R; DB Parameter 3: 100mW
R37 = Res 22k 1% 100mW 0603: Resistor 22k 1% 100mW 0603; Manufacturer: Vishay Dale; Manufacturer Part Number: CRCW060322K0FKEAC; Temperature Coefficient: ±100ppm/°C; Production Status: Active; Distributor: Digi-Key; Distributor Part Number: 541-4036-1-ND; Last Revision Date: 01.04.2021; Temperature Range: -55°C ~ +155°C; Mounting: SMD; ComponentLink1Description: Datasheet; ComponentLink1URL: https://www.vishay.com/docs/28773/crcwce3.pdf; ComponentLink2Description: Distributor; ComponentLink2URL: https://www.digikey.com/en/products/detail/vishay-dale/CRCW060322K0FKEAC/7928458; ComponentLink3Description: Manufacturer; ComponentLink3URL: https://www.vishay.com/docs/28773/crcwce3.pdf; Status: Not Checked; Power Rating: 100mW; Tolerance: ±1%; DB Parameter 1: 22k; DB Parameter 2: ±1%; DB Parameter 3: 100mW
R38 = Res 10R 1% 500mW 1206: Resistor 10R 1% 500mW 1206; Manufacturer: Stackpole Electronics Inc; Manufacturer Part Number: RNCP1206FTD10R0; Temperature Coefficient: ±100ppm/°C; Production Status: Active; Distributor: Digi-Key; Distributor Part Number: RNCP1206FTD10R0CT-ND; Last Revision Date: 11.03.2021; Temperature Range: -55°C ~ +155°C; Mounting: SMD; ComponentLink1Description: Datasheet; ComponentLink1URL: https://www.seielect.com/Catalog/SEI-RNCP.pdf; ComponentLink2Description: Distributor; ComponentLink2URL: https://www.digikey.com/en/products/detail/stackpole-electronics-inc/RNCP1206FTD10R0/2240304; ComponentLink3Description: Manufacturer; ComponentLink3URL: https://www.seielect.com/Catalog/SEI-RNCP.pdf; Status: Not Checked; Power Rating: 500mW; Tolerance: ±1%; DB Parameter 1: 10R; DB Parameter 2: ±1%; DB Parameter 3: 500mW
R39 R40 = Res 0R 1W 2512 MS: Resistor 0R 1W 2512; Manufacturer: Bourns Inc.; Manufacturer Part Number: CR2512-J/-000ELF; DB Parameter 2: 2A; Production Status: Active; Maximum Current: 5A; Distributor: Digi-Key; Distributor Part Number: CR2512-J/-000ELFCT-ND; Last Revision Date: 02.04.2021; Temperature Range: -55°C ~ +155°C; Mounting: SMD; ComponentLink1Description: Datasheet; ComponentLink1URL: https://www.bourns.com/docs/product-datasheets/CRxxxxx.pdf; ComponentLink2Description: Distributor; ComponentLink2URL: https://www.digikey.com/en/products/detail/bourns-inc/CR2512-J-000ELF/2345096; ComponentLink3Description: Manufacturer; ComponentLink3URL: https://www.bourns.com/docs/product-datasheets/CRxxxxx.pdf; Status: Not Checked; Power Rating: 1W; DB Parameter 1: 0R; DB Parameter 3: 1W; Rated Current: 2A
R41 = Res 36k 1% 100mW 0603 MS Pt02: Resistor 36k 1% 100mW 0603; Manufacturer: Yageo; Manufacturer Part Number: RC0603FR-0736KL; Temperature Coefficient: ±100ppm/°C; Production Status: Active; Distributor: Digi-Key; Distributor Part Number: 311-36.0KHRCT-ND; Last Revision Date: 26.07.2021; Temperature Range: -55°C ~ +155°C; Mounting: SMD; ComponentLink1Description: Datasheet; ComponentLink1URL: https://www.yageo.com/upload/media/product/productsearch/datasheet/rchip/PYu-RC_Group_51_RoHS_L_11.pdf; ComponentLink2Description: Distributor; ComponentLink2URL: https://www.digikey.com/en/products/detail/yageo/RC0603FR-0736KL/727179; ComponentLink3Description: Manufacturer; ComponentLink3URL: https://www.yageo.com/en/ProductSearch/PartNumberSearch?part_number=RC0603FR-0736KL; Status: Not Checked; Power Rating: 100mW; Tolerance: ±1%; DB Parameter 1: 36k; DB Parameter 2: ±1%; DB Parameter 3: 100mW
R92 = Res 499k 1% 100mW 0603 MS: Resistor 499k 1% 100mW 0603; Manufacturer: Panasonic Electronic Components; Manufacturer Part Number: ERJ-3EKF4993V; Temperature Coefficient: ±100 PPM/°C; Production Status: Active; Distributor: Digi-Key; Distributor Part Number: P499KHCT-ND; Last Revision Date: 11.07.2021; Temperature Range: -55°C ~ +155°C; Mounting: SMD; ComponentLink1Description: Datasheet; ComponentLink1URL: https://industrial.panasonic.com/cdbs/www-data/pdf/RDA0000/AOA0000C304.pdf; ComponentLink2Description: Distributor; ComponentLink2URL: https://www.digikey.com/en/products/detail/panasonic-electronic-components/ERJ-3EKF4993V/196382; ComponentLink3Description: Manufacturer; ComponentLink3URL: https://na.industrial.panasonic.com/search/Search%20Options/ERJ-3EKF4993V; Status: Not Checked; Power Rating: 100mW; Tolerance: ±1%; DB Parameter 1: 499k; DB Parameter 2: 100mW; DB Parameter 3: ±1%
R95 = Ind 5.3uH 2.3A 2323  MS: Inductor 5.3uH 2.3A 40 MOHM; Manufacturer: Wurth Elektronik; Manufacturer Part Number: 744053005; Tolerance: ±30%; DC Resistance: 0.04R; Core Material: Ferrite; DB Parameter 2: 7.7A; Rated Current: 1.9A; Distributor: Mouser; Distributor Part Number: 710-744053005; Last Revision Date: 01.11.2022; Temperature Range: -40°C ~ +125°C; Mounting: SMD; ComponentLink1Description: Datasheet; ComponentLink1URL: https://www.we-online.com/catalog/datasheet/744053005.pdf; ComponentLink2Description: Distributor; ComponentLink2URL: https://eu.mouser.com/ProductDetail/Wurth-Elektronik/744053005?qs=PGXP4M47uW6y7VIGFQ%252BMog%3D%3D; ComponentLink3Description: Manufacturer; ComponentLink3URL: https://www.we-online.com/catalog/en/WE-TPC?sq=744053005&sp=https%3A%2F%2Fwww.we-online.com%2Fweb%2Fen%2Fwuerth_elektronik%2Fsearchpage.php%3Fsearch%3D744053005#744053005; Status: Not Checked; Saturation Current: 2.3A; DB Parameter 1: 5.3uH; DB Parameter 3: 0.04R
R101 = Res 10k 1% 100mW 0603: Resistor 10k 1% 100mW 0603; Manufacturer: Yageo; Manufacturer Part Number: RC0603FR-1310KL; Temperature Coefficient: ±100 PPM/°C; Production Status: Active; Distributor: Digi-Key; Distributor Part Number: 13-RC0603FR-1310KLCT-ND; Last Revision Date: 26.07.2021; Temperature Range: -55°C ~ +155°C; Mounting: SMD; ComponentLink1Description: Datasheet; ComponentLink1URL: https://www.yageo.com/upload/media/product/productsearch/datasheet/rchip/PYu-RC_Group_51_RoHS_L_11.pdf; ComponentLink2Description: Distributor; ComponentLink2URL: https://www.digikey.com/en/products/detail/yageo/RC0603FR-1310KL/12756399; ComponentLink3Description: Manufacturer; ComponentLink3URL: https://www.yageo.com/en/ProductSearch/PartNumberSearch?part_number=RC0603FR-1310KL; Status: Not Checked; Power Rating: 100mW; Tolerance: ±1%
R119 R121 = Res 100k 1% 100mW 0603 Pt02: Resistor 100k 1% 100mW 0603; Manufacturer: Stackpole Electronics Inc; Manufacturer Part Number: RMCF0603FT100K; Temperature Coefficient: ±100ppm/°C; Production Status: Active; Distributor: Digi-Key; Distributor Part Number: RMCF0603FT100KCT-ND; Last Revision Date: 28.10.2020; Temperature Range: -55°C ~ +155°C; Mounting: SMD; ComponentLink1Description: Datasheet; ComponentLink1URL: https://www.seielect.com/catalog/sei-rmcf_rmcp.pdf; ComponentLink2Description: Distributor; ComponentLink2URL: https://www.digikey.com/en/products/detail/stackpole-electronics-inc/RMCF0603FT100K/1761112; ComponentLink3Description: Manufacturer; ComponentLink3URL: https://www.seielect.com/; Status: Not Checked; Power Rating: 100mW; Tolerance: ±1%; DB Parameter 1: 100k; DB Parameter 2: ±1%; DB Parameter 3: 100mW
R122 = Res 100R 1% 100mW 0603 MS Pt02: Resistor 100R 1% 100mW 0603; Manufacturer: Stackpole Electronics Inc; Manufacturer Part Number: RMCF0603FT100R; Temperature Coefficient: 100ppm/°C; Production Status: Active; Distributor: Digi-Key; Distributor Part Number: RMCF0603FT100RCT-ND; Last Revision Date: 26.07.2021; Temperature Range: -55°C ~ +155°C; Mounting: SMD; ComponentLink1Description: Datasheet; ComponentLink1URL: https://www.seielect.com/catalog/sei-rmcf_rmcp.pdf; ComponentLink2Description: Distributor; ComponentLink2URL: https://www.digikey.com/en/products/detail/stackpole-electronics-inc/RMCF0603FT100R/1761113; ComponentLink3Description: Manufacturer; ComponentLink3URL: https://www.seielect.com/catalog/sei-rmcf_rmcp.pdf; Status: Not Checked; Power Rating: 100mW; Tolerance: ±1%; DB Parameter 1: 100R; DB Parameter 2: ±1%; DB Parameter 3: 100mW